# EAGLE design solo_cidlo (EAGLE 9.0.1)
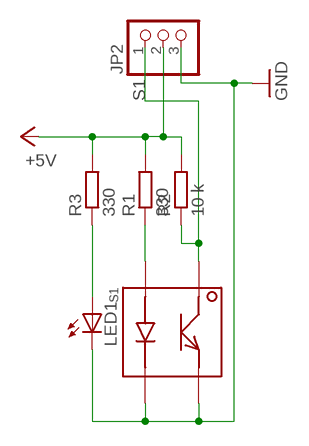
[diagram p0: schematic, sheet 1]

## Parts
JP2  PINHD-1X3  [1X03]
LED1  LEDCHIPLED_0603  [CHIPLED_0603]
R1  330  R-EU_MELF0102W  [MINI_MELF-0102W]
R2  10 k  R-EU_MELF0102W  [MINI_MELF-0102W]
R3  330  R-EU_R0201  [R0201]
S1  QRD1114  [QRD1114]

## Nets
+5V: JP2.2 R1.2 R2.2 R3.2
GND: JP2.3 LED1.C S1.P$2 S1.P$4
IL1: R1.1 S1.P$3
KL1: LED1.A R3.1
S1: JP2.1 R2.1 S1.P$1

## Library data of the parts
JP2 = pinhead:PINHD-1X3: PIN HEADER
LED1 = led:LED: LED OSRAM: - CHIPLED LG R971, LG N971, LY N971, LG Q971, LY Q971, LO R971, LY R971 LH N974, LH R974 LS Q976, LO Q976, LY Q976 LO Q996 - Hyper CHIPLED LW Q18S LB Q993, LB Q99A, LB R99A - SideLED LS A670, LO A670, LY A670, LG A670, LP A670 LB A673, LV A673, LT A673, LW A673 LH A674 LY A675 LS A676, LA A676, LO A676, LY A676, LW A676 LS A679, LY A679, LG A679 - Hyper Micro SIDELED® LS Y876, LA Y876, LO Y876, LY Y876 LT Y87S - SmartLED LW L88C, LW L88S LB L89C, LB L89S, LG L890 LS L89K, LO L89K, LY L89K LS L896, LA L896, LO L896, LY L896 - TOPLED LS T670, LO T670, LY T670, LG T670, LP T670 LSG T670, LSP T670, LSY T670, LOP T670, LYG T670 LG T671, LOG T671, LSG T671 LB T673, LV T673, LT T673, LW T673 LH T674 LS T676, LA T676, LO T676, LY T676, LB T676, LH T676, LSB T676, LW T676 LB T67C, LV T67C, LT T67C, LS T67K, LO T67K, LY T67K, LW E67C LS E67B, LA E67B, LO E67B, LY E67B, LB E67C, LV E67C, LT E67C LW T67C LS T679, LY T679, LG T679 LS T770, LO T770, LY T770, LG T770, LP T770 LB T773, LV T773, LT T773, LW T773 LH T774 LS E675, LA E675, LY E675, LS T675 LS T776, LA T776, LO T776, LY T776, LB T776 LHGB T686 LT T68C, LB T68C - Hyper Mini TOPLED® LB M676 - Mini TOPLED Santana® LG M470 LS M47K, LO M47K, LY M47K Source: http://www.osram.convergy.de LUXEON: - LUMILED® LXK2-PW12-R00, LXK2-PW12-S00, LXK2-PW14-U00, LXK2-PW14-V00 LXK2-PM12-R00, LXK2-PM12-S00, LXK2-PM14-U00 LXK2-PE12-Q00, LXK2-PE12-R00, LXK2-PE12-S00, LXK2-PE14-T00, LXK2-PE14-U00 LXK2-PB12-K00, LXK2-PB12-L00, LXK2-PB12-M00, LXK2-PB14-N00, LXK2-PB14-P00, LXK2-PB14-Q00 LXK2-PR12-L00, LXK2-PR12-M00, LXK2-PR14-Q00, LXK2-PR14-R00 LXK2-PD12-Q00, LXK2-PD12-R00, LXK2-PD12-S00 LXK2-PH12-R00, LXK2-PH12-S00 LXK2-PL12-P00, LXK2-PL12-Q00, LXK2-PL12-R00 Source: www.luxeon.com KINGBRIGHT: KA-3528ASYC Source: www.kingbright.com
R1-R3 = resistor:R-EU_: RESISTOR, European symbol
S1 = QRD1114:QRD1114; AVAILABILITY: Good; DESCRIPTION: QRD1114 Series 30 V 50 mA Phototransistor Reflective Object Sensor; MF: ON Semiconductor; MP: QRD1114; PACKAGE: Radial-4 ON Semiconductor; PRICE: 0.97 USD

## Board
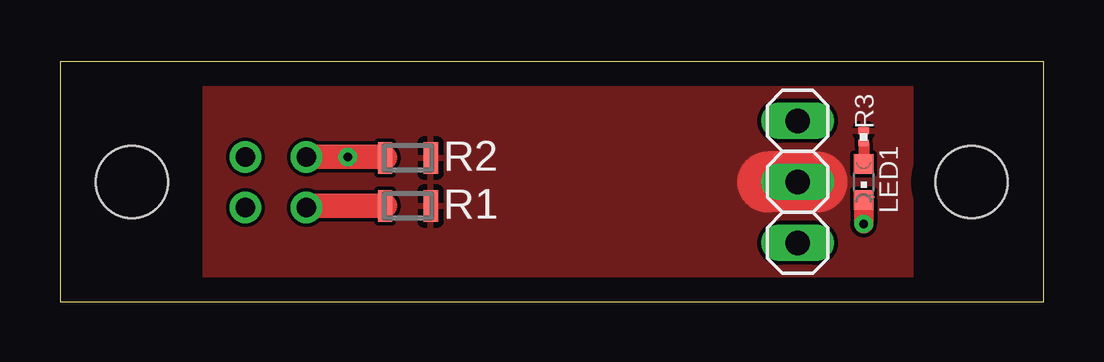
[diagram p1: board, top side]
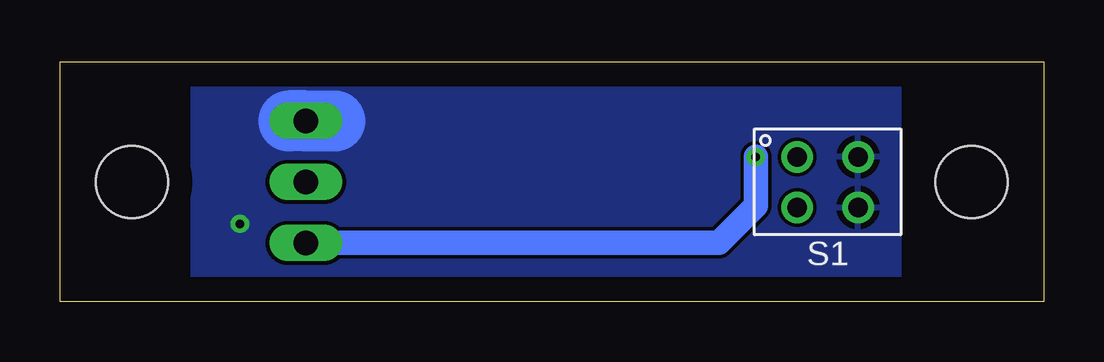
[diagram p2: board, bottom side, seen from below]

Size 41 x 10 mm. Coordinates in mm from the lower left corner, seen from the top.
Outline: 0,0 41,0 41,10 0,10 0,0
Copper layers (1*16): Top 0.035mm / dielectric 1.5mm / Bottom 0.035mm
Design rules "default": minimum track width 6mil, minimum drill 0.35mm, track to track 6mil, track to pad 6mil, pad to pad 6mil, via to via 6mil, smd to smd 6mil, copper to edge 40mil, drill to drill 6mil, minimum pad ring 10mil, minimum via ring 8mil, stop-mask expansion 4mil, vias tented up to drill 0mil, thermal gap 10mil
Holes 3 mm at 3,5 38,5

### Footprints (pad centres in the part's own frame; a part is rotated, then mirrored left to right if it is on the bottom)
1X03 = drill 1.016 long: 1 -2.54,0; 2 0,0; 3 2.54,0
CHIPLED_0603 = smd 0.8 x 0.8: A 0,-0.75; C 0,0.75
MINI_MELF-0102W = smd 0.6 x 1.3: 1 -0.95,0; 2 0.95,0
R0201 = smd 0.28 x 0.43: 1 -0.255,0; 2 0.255,0
QRD1114 = drill 0.8: P$1 -1.041,-1.27; P$2 -1.041,1.27; P$3 1.067,-1.27; P$4 1.067,1.27

### Placement (x,y rotation side)
JP2  30.75,5 90 top
LED1  33.5,5 180 top
R1  14.5,4 0 top
R2  14.5,6 0 top
R3  33.5,6.88 90 top
S1  9,5 270 bottom

### Tracks (layer width: path | path; a pad name or v marks a point on that pad's centre or on a via)
+5V
  Top 2.54: 29.5,5 JP2.2 31.56,5
  pour Top: 6,10 6,0 35.5,0 35.5,10
GND  (via drill 0.35)
  Top 0.813: LED1.C v33.5,3.25
  Bottom 2.54: 31.46,7.54 JP2.3 29.54,7.54
  pour Bottom: 6,10 6,0 35.5,0 35.5,10
IL1
  Top 1.016: R1.1 10.34,4 S1.P$3
KL1
  Top 0.45: R3.1 LED1.A
S1  (via drill 0.35)
  Top 1.016: R2.1 13.51,6.04 v12,6.04 S1.P$1
  Bottom 1.016: v12,6.04 12,4 13.54,2.46 JP2.1

### Text on the board
tTest: GND | ° | VCC | S1
tDocu: S1 | ° | QRD_1114-solo_0,1
bDocu: ° | QRD_1114-solo_0,1